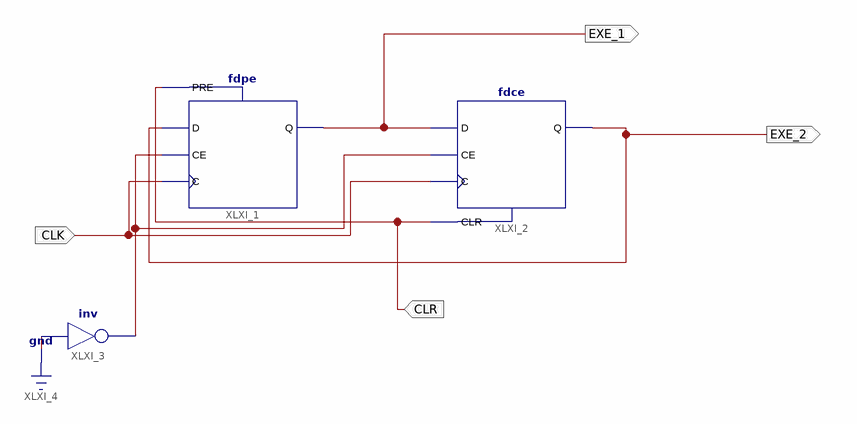
[diagram p0: schematic sheet 1]
// Xilinx ISE schematic SEQUENCE.sch (spartan3e) as structural Verilog: 3 symbols, 4 ports
module SEQUENCE (
  input  CLK,
  input  CLR,
  output EXE_1,
  output EXE_2
);

  wire XLXN_3;

  fdpe XLXI_1 (.C(CLK), .CE(XLXN_3), .D(EXE_2), .PRE(CLR), .Q(EXE_1));
  fdce XLXI_2 (.C(CLK), .CE(XLXN_3), .CLR(CLR), .D(EXE_1), .Q(EXE_2));
  not XLXI_3 (XLXN_3, 1'b0);
endmodule
